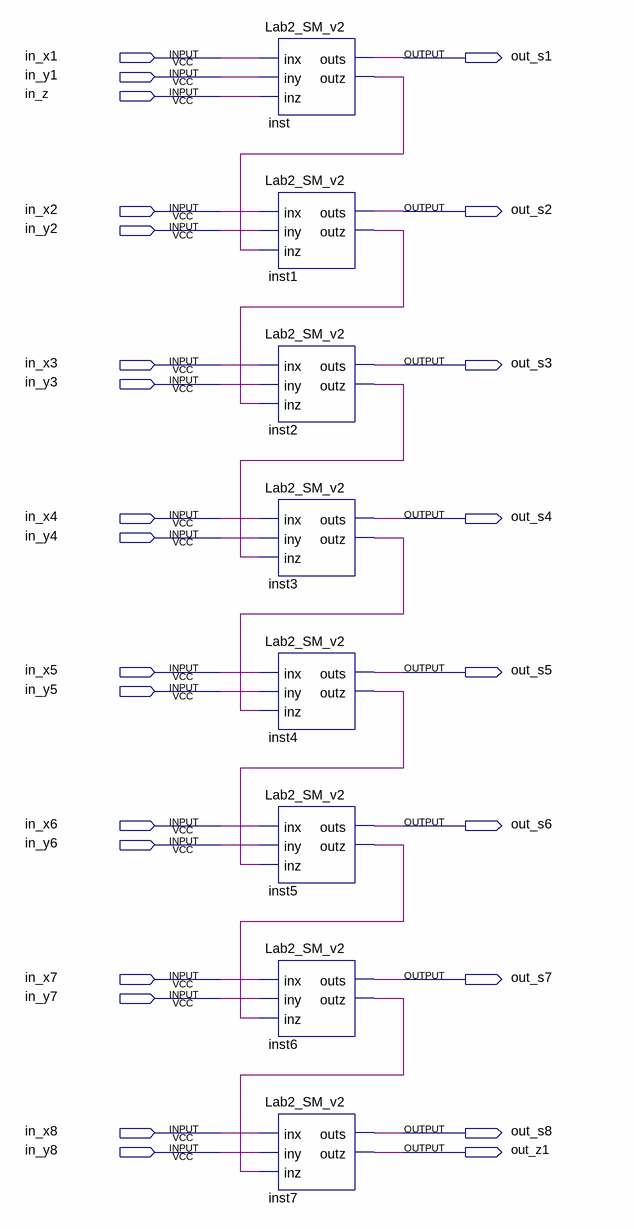
[diagram p0: schematic sheet]
// Quartus schematic Block_Dominskyi_SM.bdf as structural Verilog: 8 symbols, 26 pins
module Block_Dominskyi_SM (
  input  in_x1,
  input  in_y1,
  input  in_z,
  input  in_x2,
  input  in_y2,
  input  in_x3,
  input  in_y3,
  input  in_x4,
  input  in_y4,
  input  in_x5,
  input  in_y5,
  input  in_x6,
  input  in_y6,
  input  in_x7,
  input  in_y7,
  input  in_x8,
  input  in_y8,
  output out_s1,
  output out_s2,
  output out_s3,
  output out_s4,
  output out_s5,
  output out_s6,
  output out_s7,
  output out_s8,
  output out_z1
);

  wire inst1_outz, inst2_outz, inst3_outz, inst4_outz, inst5_outz, inst6_outz, inst_outz;

  Lab2_SM_v2 inst (.inx(in_x1), .iny(in_y1), .inz(in_z), .outs(out_s1), .outz(inst_outz));
  Lab2_SM_v2 inst1 (.inx(in_x2), .iny(in_y2), .inz(inst_outz), .outs(out_s2), .outz(inst1_outz));
  Lab2_SM_v2 inst2 (.inx(in_x3), .iny(in_y3), .inz(inst1_outz), .outs(out_s3), .outz(inst2_outz));
  Lab2_SM_v2 inst3 (.inx(in_x4), .iny(in_y4), .inz(inst2_outz), .outs(out_s4), .outz(inst3_outz));
  Lab2_SM_v2 inst4 (.inx(in_x5), .iny(in_y5), .inz(inst3_outz), .outs(out_s5), .outz(inst4_outz));
  Lab2_SM_v2 inst5 (.inx(in_x6), .iny(in_y6), .inz(inst4_outz), .outs(out_s6), .outz(inst5_outz));
  Lab2_SM_v2 inst6 (.inx(in_x7), .iny(in_y7), .inz(inst5_outz), .outs(out_s7), .outz(inst6_outz));
  Lab2_SM_v2 inst7 (.inx(in_x8), .iny(in_y8), .inz(inst6_outz), .outs(out_s8), .outz(out_z1));
endmodule
